# EAGLE design power_distribution (EAGLE 7.5.0)
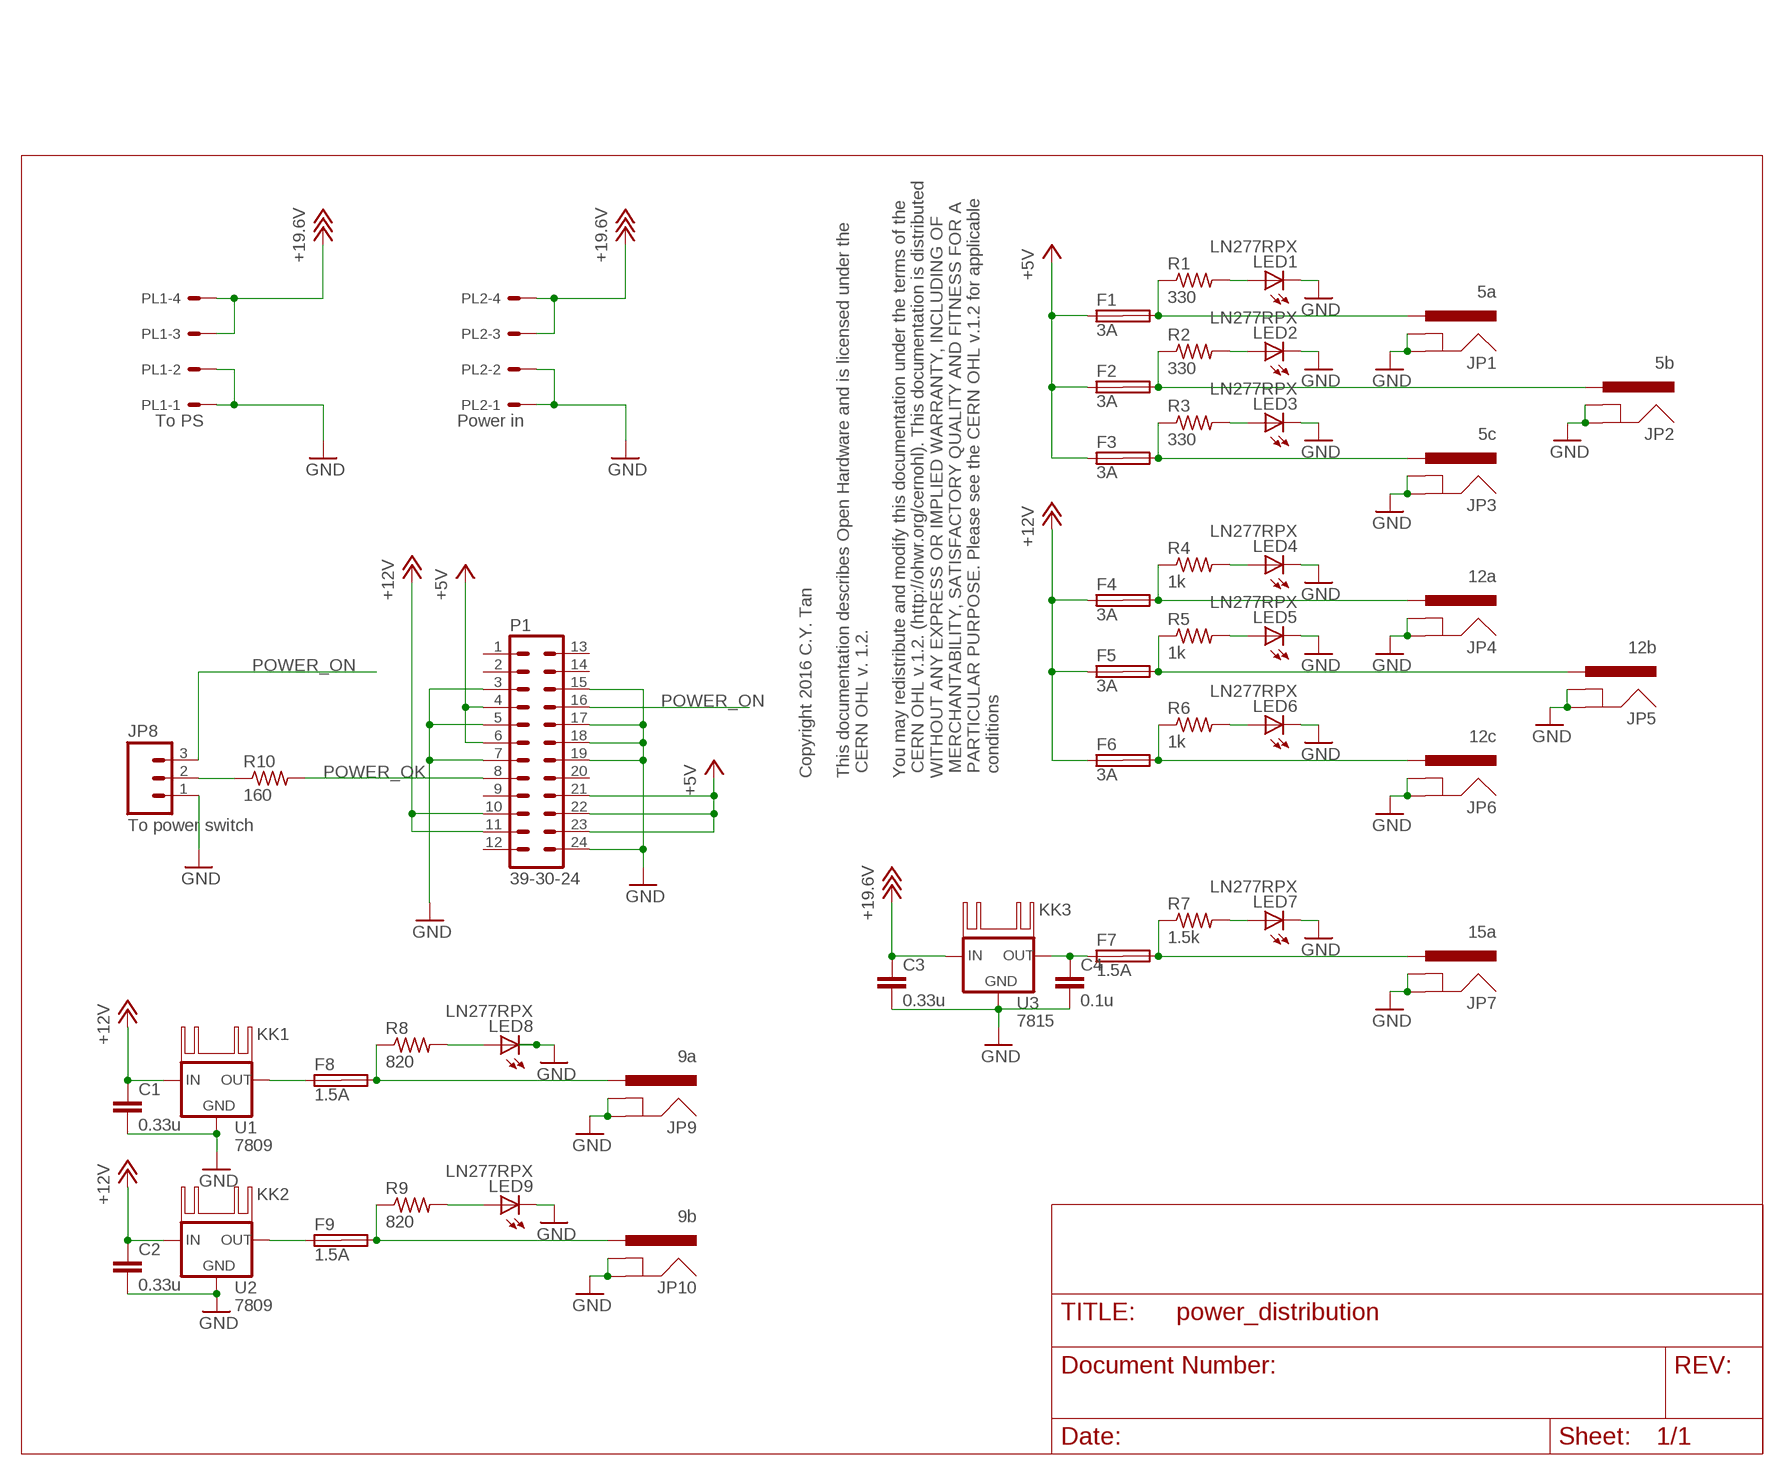
[diagram p0: schematic, sheet 1]

## Parts
C1  0.33u  CAPPTH1  [CAP-PTH-5MM]
C2  0.33u  CAPPTH1  [CAP-PTH-5MM]
C3  0.33u  CAPPTH1  [CAP-PTH-5MM]
C4  0.1u  CAPPTH1  [CAP-PTH-5MM]
F1  3A  SH32  [SH32]
F2  3A  SH32  [SH32]
F3  3A  SH32  [SH32]
F4  3A  SH32  [SH32]
F5  3A  SH32  [SH32]
F6  3A  SH32  [SH32]
F7  1.5A  SH32  [SH32]
F8  1.5A  SH32  [SH32]
F9  1.5A  SH32  [SH32]
JP1  5a  POWER_JACK  [POWER_JACK_V_PTH]
JP2  5b  POWER_JACK  [POWER_JACK_V_PTH]
JP3  5c  POWER_JACK  [POWER_JACK_V_PTH]
JP4  12a  POWER_JACK  [POWER_JACK_V_PTH]
JP5  12b  POWER_JACK  [POWER_JACK_V_PTH]
JP6  12c  POWER_JACK  [POWER_JACK_V_PTH]
JP7  15a  POWER_JACK  [POWER_JACK_V_PTH]
JP8  To power switch  M03PTH  [1X03]
JP9  9a  POWER_JACK  [POWER_JACK_V_PTH]
JP10  9b  POWER_JACK  [POWER_JACK_V_PTH]
KK1  TO-220_HEATSINK_4W  [TO-220-HEATSINK-4W]
KK2  TO-220_HEATSINK_4W  [TO-220-HEATSINK-4W]
KK3  TO-220_HEATSINK_4W  [TO-220-HEATSINK-4W]
LED1  LN277RPX  [LED3MM]
LED2  LN277RPX  [LED3MM]
LED3  LN277RPX  [LED3MM]
LED4  LN277RPX  [LED3MM]
LED5  LN277RPX  [LED3MM]
LED6  LN277RPX  [LED3MM]
LED7  LN277RPX  [LED3MM]
LED8  LN277RPX  [LED3MM]
LED9  LN277RPX  [LED3MM]
P1  39-30-24  [39-30-?24?]
PL1  To PS  555X-4H  [5569-4]
PL2  Power in  555X-4H  [5569-4]
R1  330  R-US_0207/10  [0207/10]
R2  330  R-US_0207/10  [0207/10]
R3  330  R-US_0207/10  [0207/10]
R4  1k  R-US_0207/10  [0207/10]
R5  1k  R-US_0207/10  [0207/10]
R6  1k  R-US_0207/10  [0207/10]
R7  1.5k  R-US_0207/10  [0207/10]
R8  820  R-US_0207/10  [0207/10]
R9  820  R-US_0207/10  [0207/10]
R10  160  R-US_0207/10  [0207/10]
U1  7809  V_REG_78XX-TO-220  [TO-220-ALT]
U2  7809  V_REG_78XX-TO-220  [TO-220-ALT]
U3  7815  V_REG_78XX-TO-220  [TO-220-ALT]

## Nets
+5V: F1.1A F2.1A F3.1A P1.4 P1.6 P1.21 P1.22 P1.23
+12V: C1.1 C2.1 F4.1A F5.1A F6.1A P1.10 P1.11 U1.IN U2.IN
+18V: C3.1 PL1.3 PL1.4 PL2.3 PL2.4 U3.IN ; supply symbol labelled +19.6V
GND: C1.2 C2.2 C3.2 C4.2 JP1.GND JP1.GNDBREAK JP2.GND JP2.GNDBREAK JP3.GND JP3.GNDBREAK JP4.GND JP4.GNDBREAK JP5.GND JP5.GNDBREAK JP6.GND JP6.GNDBREAK JP7.GND JP7.GNDBREAK JP8.1 JP9.GND JP9.GNDBREAK JP10.GND JP10.GNDBREAK LED1.K(C) LED2.K(C) LED3.K(C) LED4.K(C) LED5.K(C) LED6.K(C) LED7.K(C) LED8.K(C) LED9.K(C) P1.3 P1.5 P1.7 P1.15 P1.17 P1.18 P1.19 P1.24 PL1.1 PL1.2 PL2.1 PL2.2 U1.GND U2.GND U3.GND
N$1: F1.2A JP1.PWR R1.1
N$2: F2.2A JP2.PWR R2.1
N$3: F3.2A JP3.PWR R3.1
N$4: LED1.A R1.2
N$5: LED2.A R2.2
N$6: LED3.A R3.2
N$7: F4.2A JP4.PWR R4.1
N$8: F5.2A JP5.PWR R5.1
N$9: F6.2A JP6.PWR R6.1
N$10: LED4.A R4.2
N$11: LED5.A R5.2
N$12: LED6.A R6.2
N$13: F8.1A U1.OUT
N$14: F7.2A JP7.PWR R7.1
N$15: LED7.A R7.2
N$16: F8.2A JP9.PWR R8.1
N$17: LED8.A R8.2
N$18: JP8.2 R10.1
N$19: F9.1A U2.OUT
N$20: F9.2A JP10.PWR R9.1
N$21: LED9.A R9.2
N$24: C4.1 F7.1A U3.OUT
POWER_OK: P1.8 R10.2
POWER_ON: JP8.3 P1.16
Unconnected: F1.1B F1.2B F2.1B F2.2B F3.1B F3.2B F4.1B F4.2B F5.1B F5.2B F6.1B F6.2B F7.1B F7.2B F8.1B F8.2B F9.1B F9.2B P1.1 P1.2 P1.9 P1.12 P1.13 P1.14 P1.20

## Notes on the sheet
- Copyright 2016 C.Y. Tan
  
  This documentation describes Open Hardware and is licensed under the
   CERN OHL v. 1.2. 
  
  You may redistribute and modify this documentation under the terms of the
   CERN OHL v.1.2. (http://ohwr.org/cernohl). This documentation is distributed 
  WITHOUT ANY EXPRESS OR IMPLIED WARRANTY, INCLUDING OF
   MERCHANTABILITY, SATISFACTORY QUALITY AND FITNESS FOR A
   PARTICULAR PURPOSE. Please see the CERN OHL v.1.2 for applicable
   conditions

## Library data of the parts
C1-C4 = SparkFun-Capacitors:CAP: Capacitor Standard 0603 ceramic capacitor, and 0.1" leaded capacitor.
F1-F9 = fuse:SH32: FUSE HOLDER 6 x 32 mm, SH contact, SHH3N Schukat, 102071 Wickmann (Buerklin); MPN: 10207101009; OC_FARNELL: 811786; OC_NEWARK: 76R6904
JP1-JP7 JP9 JP10 = cytan:POWER_JACK: Power Jack This is the standard 5.5mm barrel jack for power. The PTH is the most common, proven, reliable, footprint. The Slot footprint only works if the mill layer is transmitted to the PCB fab house so be warned. Mating wall wart : TOL-00298 (and others)
JP8 = SparkFun-Connectors:M03: Header 3 Standard 3-pin 0.1" header. Use with straight break away headers (SKU : PRT-00116), right angle break away headers (PRT-00553), swiss pins (PRT-00743), machine pins (PRT-00117), and female headers (PRT-00115). Molex polarized connector foot print use with SKU : PRT-08232 with associated crimp pins and housings.
KK1-KK3 = cytan:TO-220_HEATSINK_4W: TO-220 Heatsink 16degC/W
LED1-LED9 = cytan:LN277RPX: LED 3MM National Panasonic LN277RPX. Digikey P551-ND
P1 = cytan:39-30-?24?: ATX-24 power header
PL1 PL2 = cytan:555X-4: Mini FIT connector 4 way
R1-R10 = resistor:R-US_: RESISTOR, American symbol
U1-U3 = SparkFun-PowerIC:V_REG_78XX: Voltage Regulator Standard 78xx regulator. IGO (Input Ground Output). Spark Fun Electronics SKU : COM-00107; PROD_ID: VREG-08450; SF_ID: COM-00107

## Board
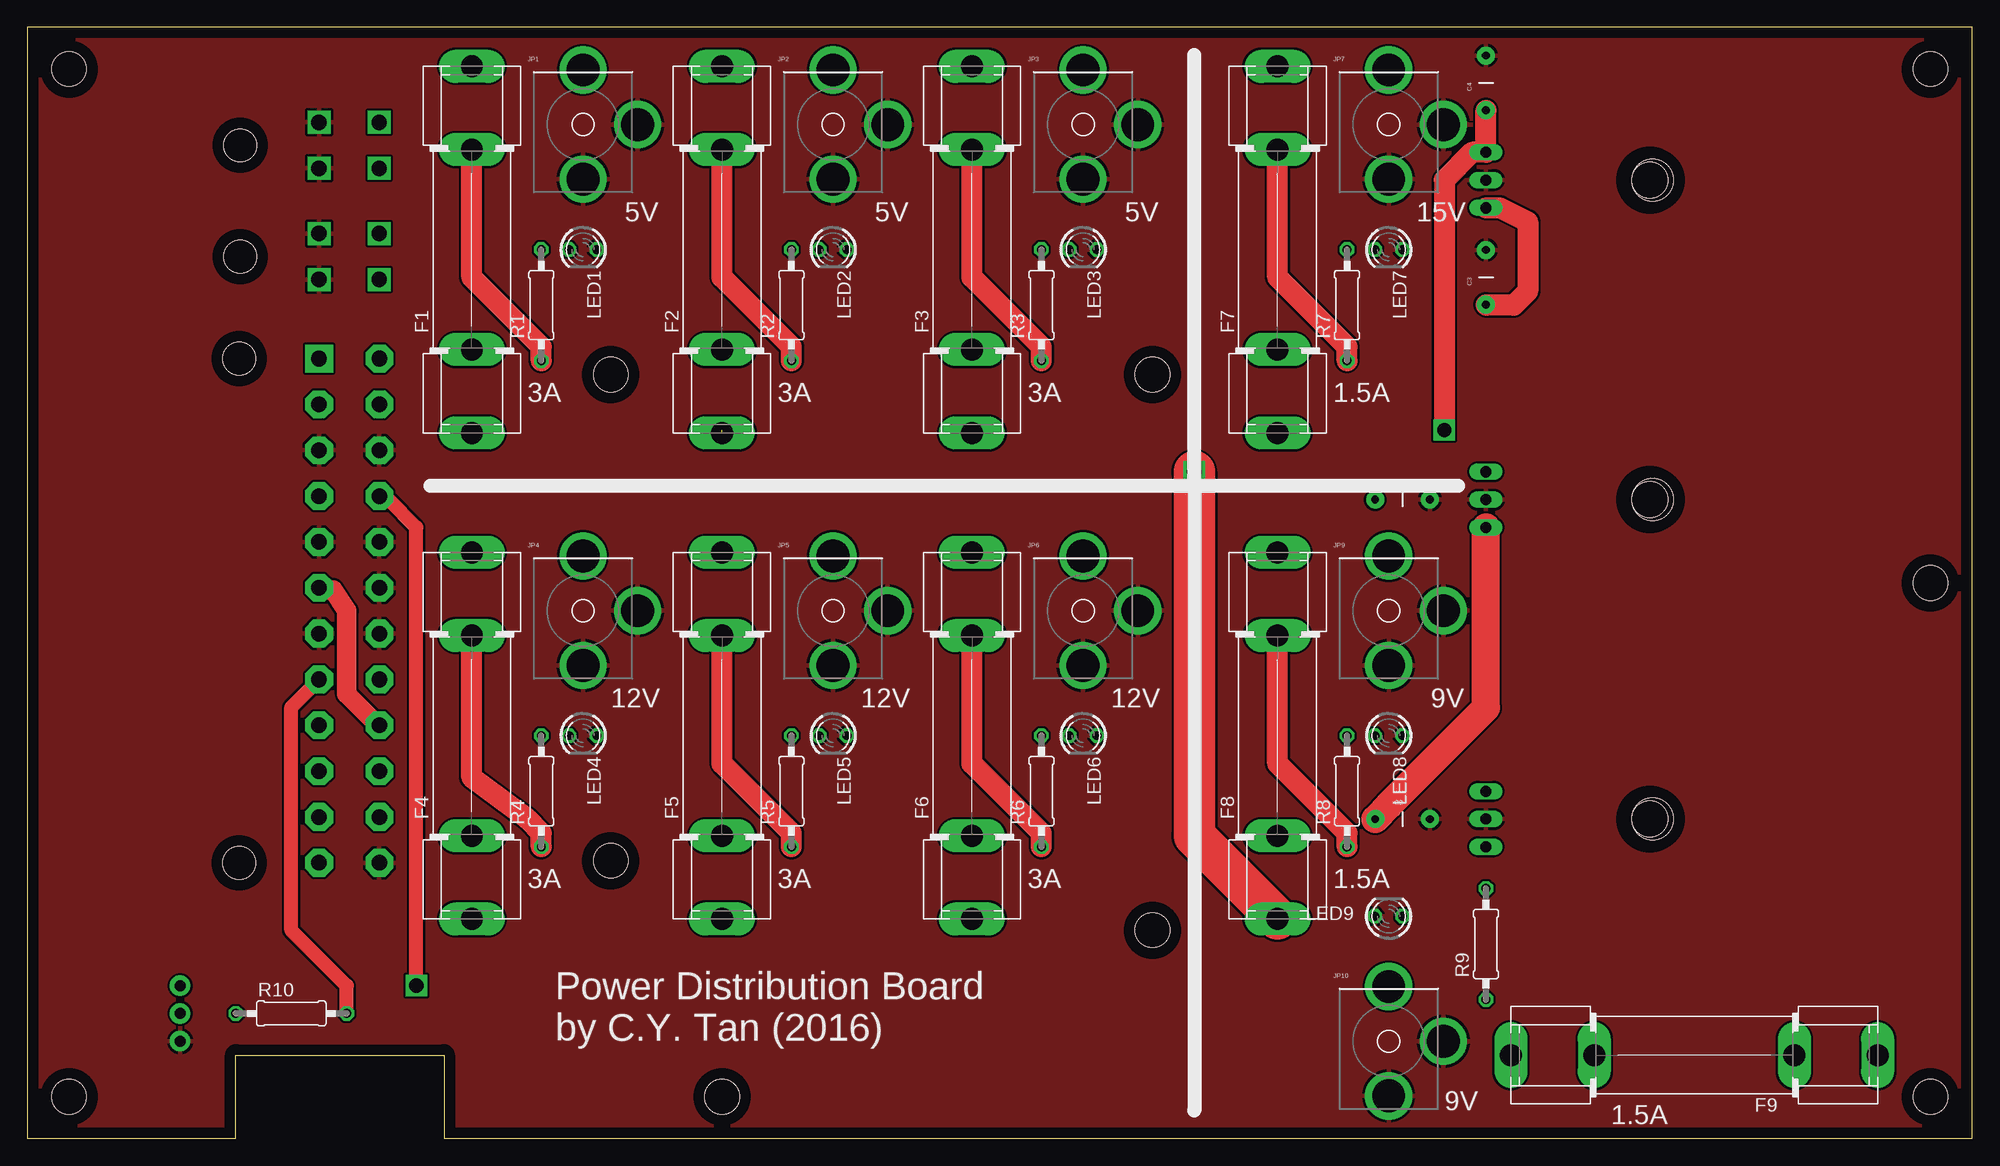
[diagram p1: board, top side]
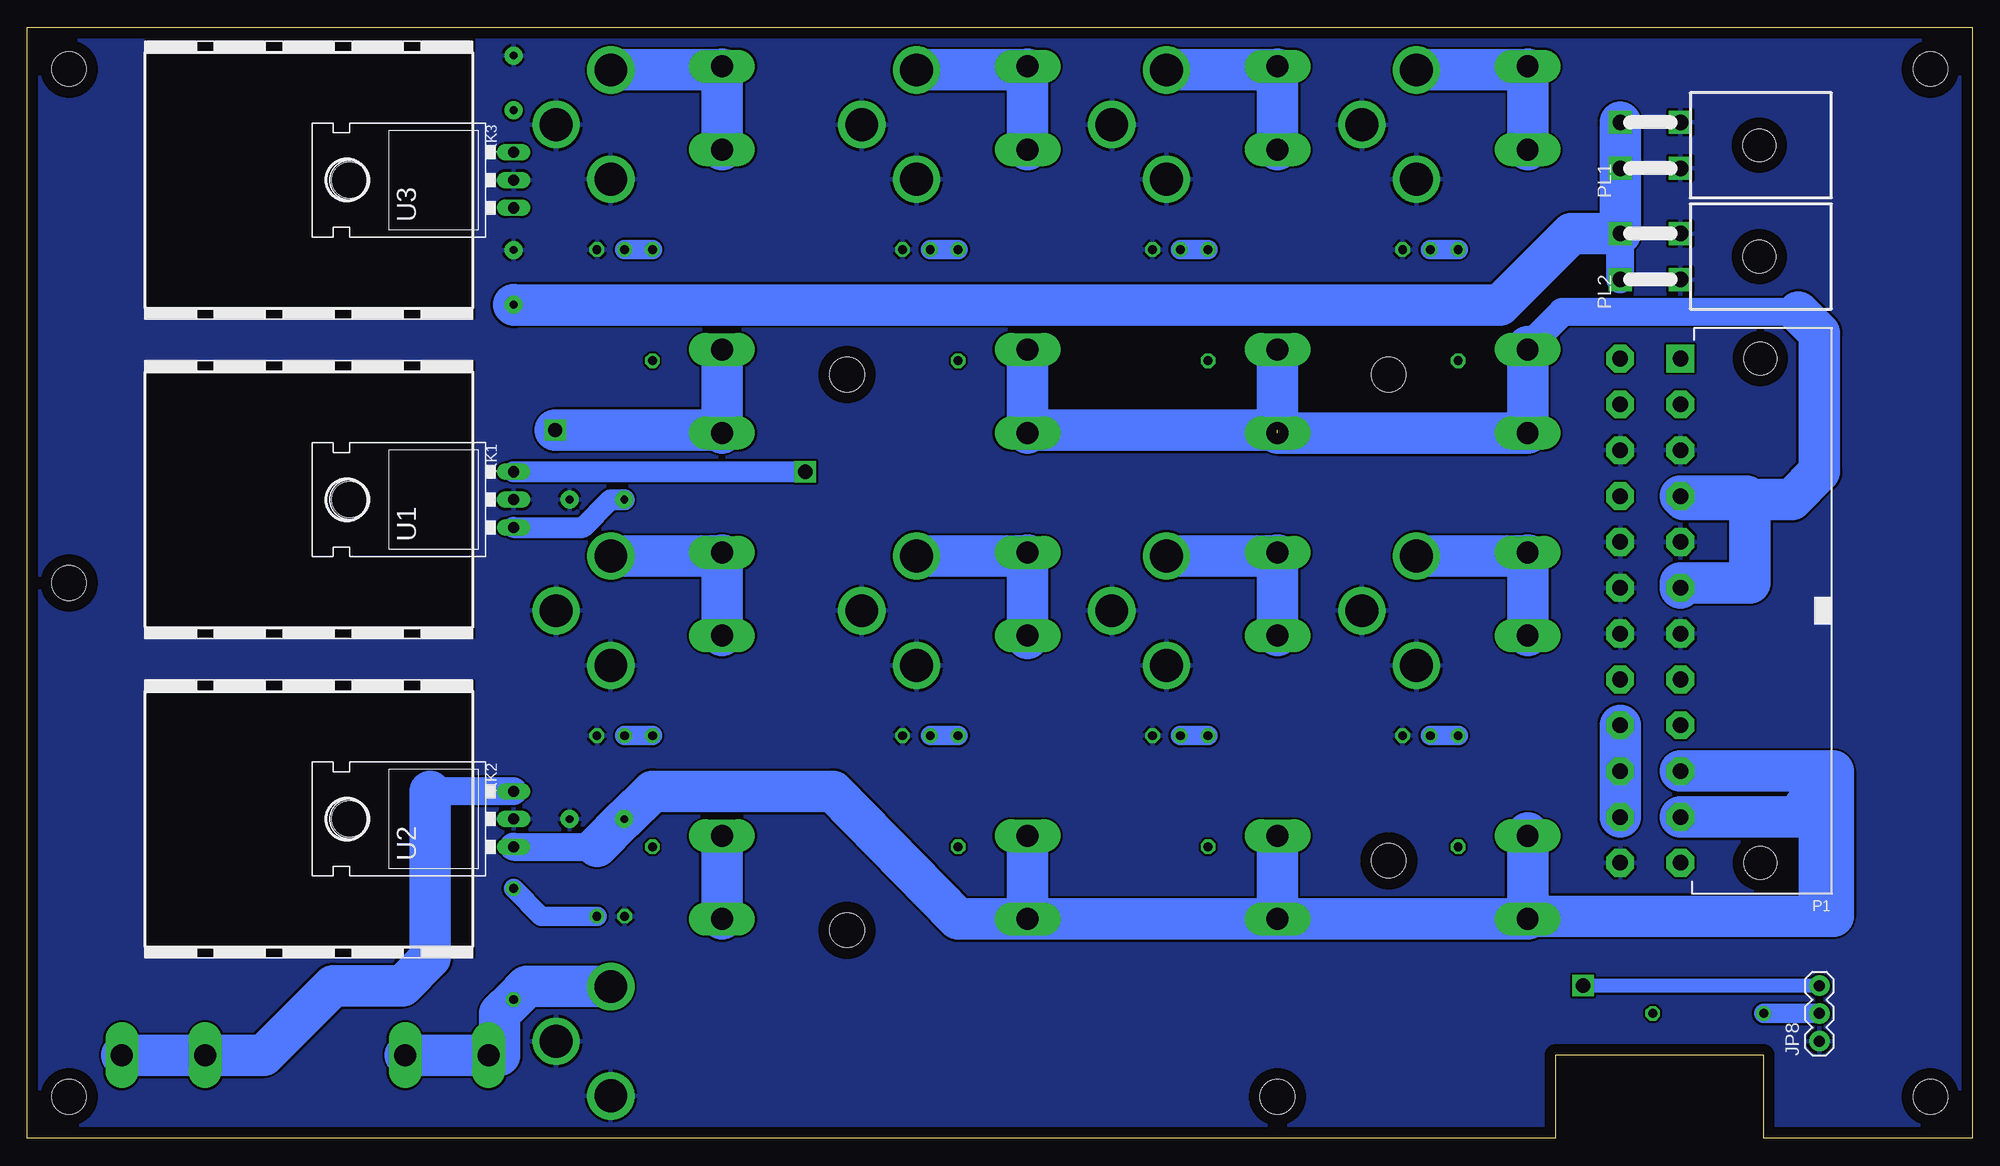
[diagram p2: board, bottom side, seen from below]

Size 177.8 x 101.6 mm. Coordinates in mm from the lower left corner, seen from the top.
Outline: 0,0 19.05,0 19.05,7.62 38.1,7.62 38.1,0 177.8,0 177.8,101.6 0,101.6 0,0
Copper layers (1*16): Top 0.035mm / dielectric 1.5mm / Bottom 0.035mm
Design rules "default": minimum track width 10mil, minimum drill 24mil, track to track 8mil, track to pad 8mil, pad to pad 8mil, via to via 8mil, smd to smd 8mil, copper to edge 40mil, drill to drill 8mil, minimum pad ring 10mil, minimum via ring 8mil, stop-mask expansion 4mil, vias tented up to drill 0mil, thermal gap 10mil
Holes 3.17 mm at 3.81,97.79 173.99,97.79 173.99,3.81 3.81,3.81 102.87,69.85 102.87,19.05 63.5,3.81 173.99,50.8 53.34,69.85 53.34,25.4

### Footprints (pad centres in the part's own frame; a part is rotated, then mirrored left to right if it is on the bottom)
CAP-PTH-5MM = drill 0.7 pad 1.651: 1 -2.5,0; 2 2.5,0
SH32 = drill 2.007 long: 1A -16.764,0; 1B -9.144,0; 2A 9.144,0; 2B 16.764,0
POWER_JACK_V_PTH = drill 2.997 pad 4.318: GND 0,-5; GNDBREAK 5,0; PWR 0,5
1X03 = drill 1.016 pad 1.88: 1 0,0; 2 2.54,0; 3 5.08,0
TO-220-HEATSINK-4W = hole 3.81: 0,0
LED3MM = drill 0.813 octagon: A 0,-1.27; K 0,1.27
39-30-?24? = drill 1.422 pad 2.54 square: 1 23.05,0 | drill 1.422 pad 2.54 octagon: 2 18.86,0; 3 14.668,0; 4 10.477,0; 5 6.287,0; 6 2.095,0; 7 -2.095,0; 8 -6.287,0; 9 -10.477,0; 10 -14.668,0; 11 -18.86,0; 12 -23.05,0; 13 23.05,5.512; 14 18.86,5.512; 15 14.668,5.512; 16 10.477,5.512; 17 6.287,5.512; 18 2.095,5.512; 19 -2.095,5.512; 20 -6.287,5.512; 21 -10.477,5.512; 22 -14.668,5.512; 23 -18.86,5.512; 24 -23.05,5.512 | hole 3: -23.05,-7.3; 23.05,-7.3
5569-4 = drill 1.4 square: 1 2.1,0; 2 -2.1,0; 3 2.1,5.5; 4 -2.1,5.5 | hole 3: 0,-7.196
0207/10 = drill 0.813 octagon: 1 -5.08,0; 2 5.08,0
TO-220-ALT = drill 1.016 long: GND 0,-3.81; IN -2.54,-3.81; OUT 2.54,-3.81 | hole 3.302: 0,11.176

### Placement (x,y rotation side)
C1  125.73,58.42 0 top
C2  125.73,29.21 0 top
C3  133.35,78.74 90 top
C4  133.35,96.52 90 top
F1  40.64,81.28 90 top
F2  63.5,81.28 90 top
F3  86.36,81.28 90 top
F4  40.64,36.83 90 top
F5  63.5,36.83 90 top
F6  86.36,36.83 90 top
F7  114.3,81.28 90 top
F8  114.3,36.83 90 top
F9  152.4,7.62 180 top
JP1  50.8,92.71 0 top
JP2  73.66,92.71 0 top
JP3  96.52,92.71 0 top
JP4  50.8,48.26 0 top
JP5  73.66,48.26 0 top
JP6  96.52,48.26 0 top
JP7  124.46,92.71 0 top
JP8  13.97,8.89 90 bottom
JP9  124.46,48.26 0 top
JP10  124.46,8.89 0 top
KK1  148.59,58.42 180 bottom
KK2  148.59,29.21 180 bottom
KK3  148.59,87.63 180 bottom
LED1  50.8,81.28 270 top
LED2  73.66,81.28 270 top
LED3  96.52,81.28 270 top
LED4  50.8,36.83 270 top
LED5  73.66,36.83 270 top
LED6  96.52,36.83 270 top
LED7  124.46,81.28 270 top
LED8  124.46,36.83 270 top
LED9  124.46,20.32 90 top
P1  39-30-24?  [39-30-?24?]  26.67,48.26 90 bottom
PL1  26.67,90.81 90 bottom
PL2  26.67,80.64 90 bottom
R1  46.99,76.2 90 top
R2  69.85,76.2 90 top
R3  92.71,76.2 90 top
R4  46.99,31.75 90 top
R5  69.85,31.75 90 top
R6  92.71,31.75 90 top
R7  120.65,76.2 90 top
R8  120.65,31.75 90 top
R9  133.35,17.78 90 top
R10  24.13,11.43 0 top
U1  137.16,58.42 90 bottom
U2  137.16,29.21 90 bottom
U3  137.16,87.63 90 bottom

### Tracks (layer width: path | path; a pad name or v marks a point on that pad's centre or on a via)
+5V  (1 unrouted)
  Top 1.778: P1.21 32.07,37.78 29.21,40.64 29.21,48.26 27.94,50.16 26.86,50.16 P1.6
  Bottom 2.54: 15.88,75.56 37.47,75.56 40.64,72.39
  Bottom 3.81: P1.23 P1.22 P1.21 | F3.1A 86.36,64.77 | 86.36,71.12 86.36,64.77 | 86.36,64.77 63.5,64.77 63.5,71.12 | F2.1A F1.1A 40.64,72.39 | P1.4 20.64,58.74 20.32,58.42 | 20.32,58.42 20.32,50.8 26.67,50.8 P1.6 | 26.35,58.42 20.32,58.42 | 20.32,58.42 16.51,58.42 13.97,60.96 13.97,73.66 15.88,75.56
+12V
  Top 1.93: 124.46,30.48 124.5,30.48
  Top 2.54: 124.46,30.48 133.35,39.37 U1.IN | 124.5,30.48 C2.1
  Bottom 1.93: 125.73,26.67 125.73,26.71 | U1.IN 127,55.88 124.46,58.42 C1.1 | C2.1 123.19,29.21
  Bottom 2.54: U2.IN 125.73,26.67
  Bottom 3.81: 125.73,26.71 C2.1 | F6.1A F5.1A | F5.1A 63.5,26.67 | F5.1A F4.1A | F4.1A 40.64,27.94 | P1.10 12.7,33.59 12.7,20.32 13.97,20.32 | P1.11 15.24,29.4 | 15.24,29.4 13.97,29.4 13.97,20.32 | 15.24,29.4 15.24,30.48 | 13.97,20.32 16.51,20.32 40.39,20.32 F4.1A | 123.19,29.21 120.65,31.75 104.14,31.75 92.71,20.07 F6.1A | F6.1A 86.36,26.67
+18V
  Top 1.93: U3.IN 134.62,85.09 137.16,83.82 137.16,77.47 135.89,76.2 133.39,76.2 C3.1
  Bottom 2.54: PL2.4 PL2.3
  Bottom 3.81: PL1.3 PL1.4 PL2.3 36.63,82.75 43.18,76.2 133.31,76.2 C3.1
GND
  pour Top: 0,0 0,101.6 177.8,101.6 177.8,0 38.1,0 38.1,7.62 19.05,7.62 19.05,0
  pour Bottom: 0,0 0,101.6 177.8,101.6 177.8,0 38.1,0 38.1,7.62 19.05,7.62 19.05,0
N$1
  Top 1.93: R1.1 46.99,72.39 40.64,78.74 F1.2A
  Bottom 3.81: JP1.PWR 40.72,97.71 40.64,97.79 F1.2A
N$2
  Top 1.93: R2.1 69.85,72.39 63.5,78.74 F2.2A
  Bottom 3.81: JP2.PWR 63.58,97.71 63.5,97.79 F2.2A
N$3
  Top 1.93: R3.1 92.71,72.39 86.36,78.74 F3.2A
  Bottom 3.81: JP3.PWR 86.44,97.71 86.36,97.79 F3.2A
N$4
  Bottom 1.778: R1.2 LED1.A
N$5
  Bottom 1.778: R2.2 LED2.A
N$6
  Bottom 1.778: R3.2 LED3.A
N$7
  Top 1.93: R4.1 46.99,27.94 45.72,29.21 40.64,33.02 F4.2A
  Bottom 3.81: JP4.PWR 40.72,53.26 40.64,53.34 F4.2A
N$8
  Top 1.93: R5.1 69.85,27.94 63.5,34.29 F5.2A
  Bottom 3.81: JP5.PWR 63.58,53.26 63.5,53.34 F5.2A
N$9
  Top 1.93: R6.1 92.71,27.94 86.36,34.29 F6.2A
  Bottom 3.81: JP6.PWR 86.44,53.26 86.36,53.34 F6.2A 86.36,45.72
N$10
  Bottom 1.778: R4.2 LED4.A
N$11
  Bottom 1.778: R5.2 LED5.A
N$12
  Bottom 1.778: R6.2 LED6.A
N$13  (via drill 1.3)
  Top 3.81: v106.68,60.96 106.68,27.69 F8.1A
  Bottom 1.93: U1.OUT v106.68,60.96
  Bottom 3.81: F8.1A 114.3,26.67
N$14
  Top 1.93: R7.1 120.65,72.39 114.3,78.74 F7.2A
  Bottom 3.81: JP7.PWR 114.38,97.71 114.3,97.79 F7.2A
N$15
  Bottom 1.778: R7.2 LED7.A
N$16
  Top 1.93: R8.1 120.65,27.94 114.3,34.29 F8.2A
  Bottom 3.81: JP9.PWR 114.38,53.26 114.3,53.34 F8.2A
N$17
  Bottom 1.778: R8.2 LED8.A
N$18
  Bottom 1.778: R10.1 JP8.2
N$19
  Bottom 2.54: U2.OUT 140.97,31.75
  Bottom 3.81: F9.1A 156.21,7.62 149.86,13.97 143.51,13.97 140.97,16.51 140.97,31.75
N$20
  Bottom 3.81: JP10.PWR 132.16,13.89 R9.1 134.62,11.43 134.62,7.62 F9.2A
N$21
  Bottom 1.778: LED9.A 130.81,20.32 R9.2
N$24  (via drill 1.3)
  Top 1.93: C4.1 U3.OUT 132.08,90.17 129.54,87.63 v129.54,64.77
  Bottom 3.81: F7.1A 114.3,64.77 | 114.3,71.12 114.3,64.77 | 114.3,64.77 v129.54,64.77
POWER_OK
  Top 1.27: R10.2 29.21,13.97 24.13,19.05 24.13,39.43 P1.8
POWER_ON  (via drill 1.3)
  Top 1.27: v35.56,13.97 35.56,55.88 33.02,58.42 32.5,58.42 P1.16
  Bottom 1.27: JP8.3 v35.56,13.97

### Text on the board
tNames: 5V | 5V | 5V | 15V | 3A | 3A | 3A | 1.5A | 12V | 12V | 12V | 9V | 3A | 3A | 3A | 1.5A | Power Distribution Board / by C.Y. Tan (2016) | 9V | 1.5A